# EAGLE design led_1_Arduino (EAGLE 8.7.1)
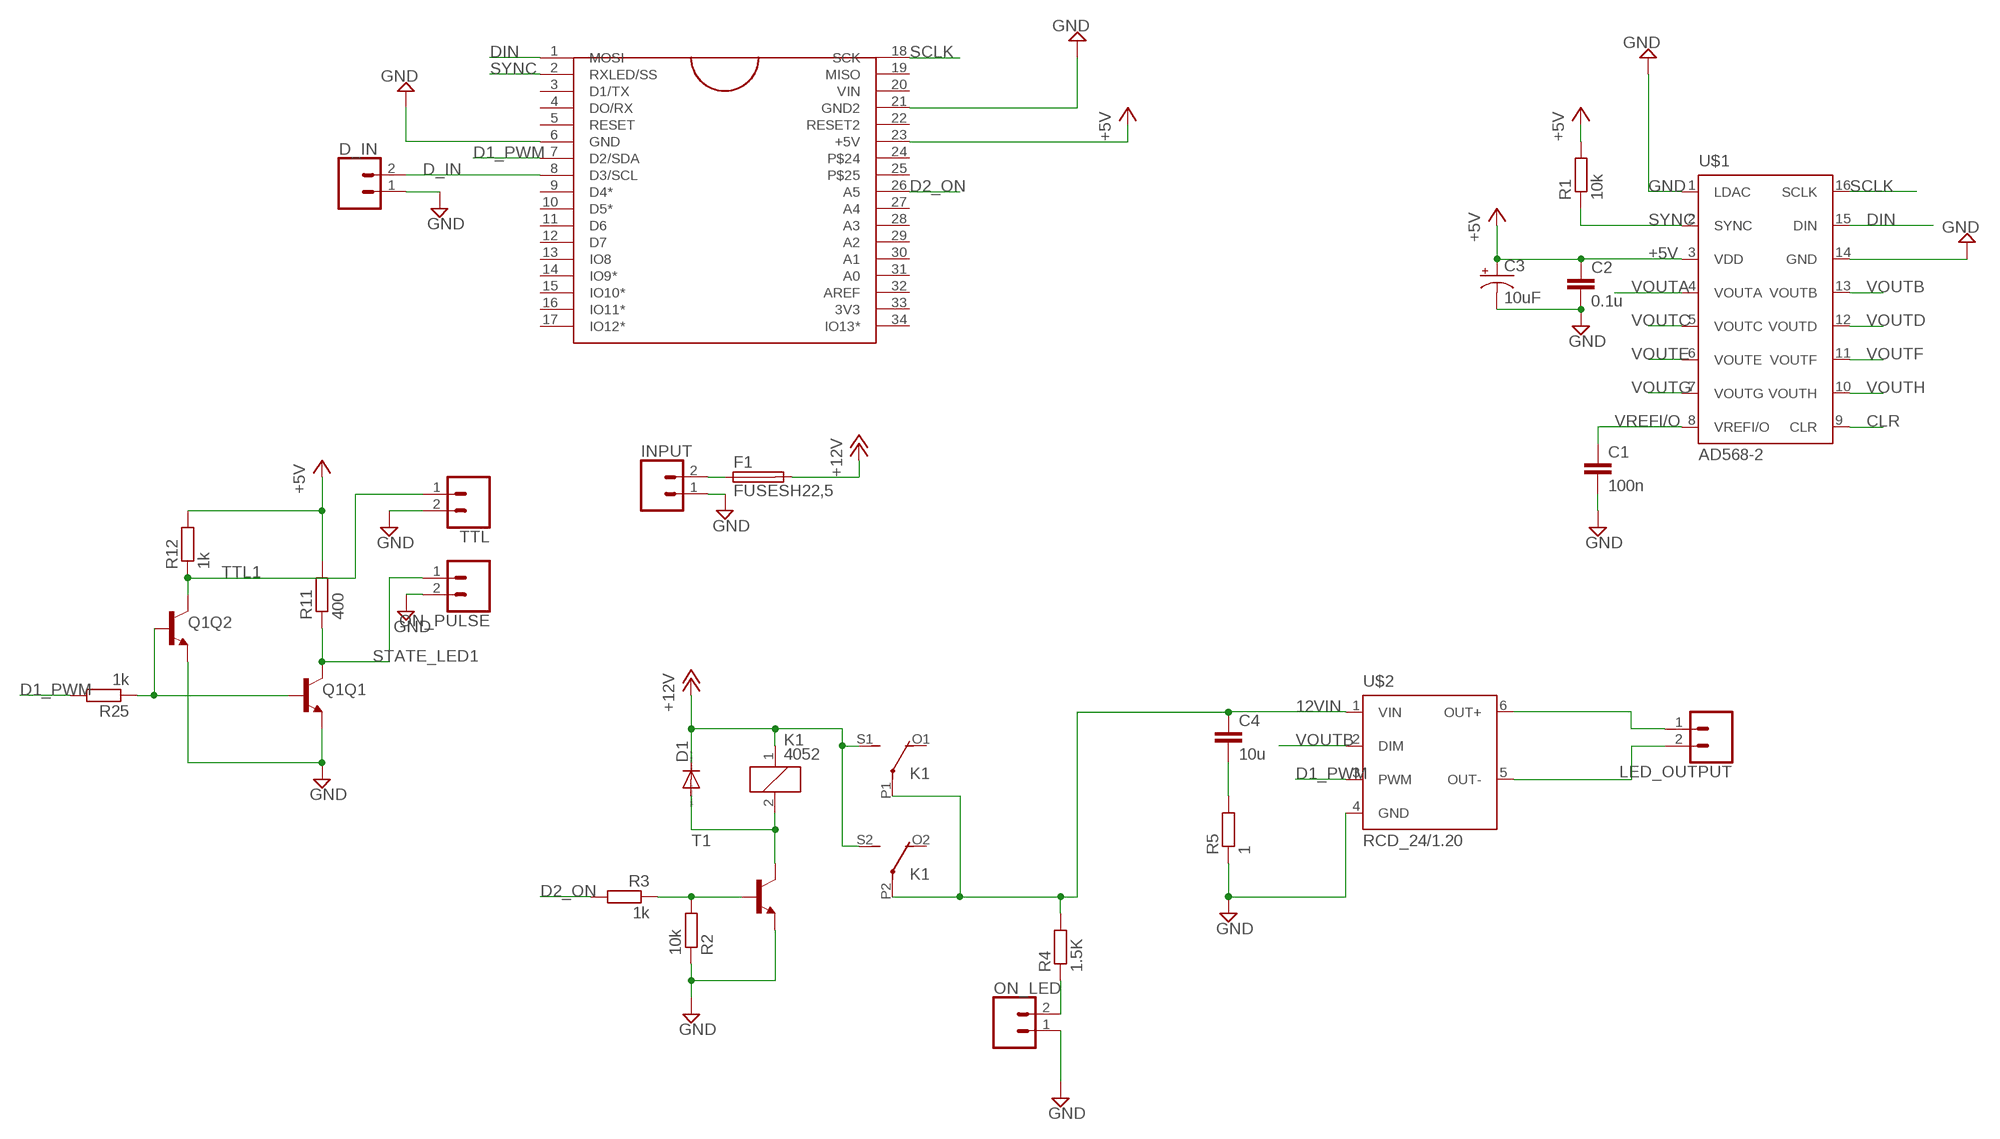
[diagram p0: schematic, sheet 1]

## Parts
C1  100n  C-EUC1206  [C1206]
C2  0.1u  C-EUC1206  [C1206]
C3  10uF  10UF-POLAR-EIA3528-20V-10%(TANT)  [EIA3528]
C4  10u  C-EUC1206  [C1206]
D1  DIODE-DO214AC  [DO214AC]
D_IN  CONN_02  [1X02]
F1  FUSESH22,5  [SH22,5]
INPUT  CONN_023.5MM  [SCREWTERMINAL-3.5MM-2]
K1  4052  [F4052]
LED_OUTPUT  CONN_023.5MM  [SCREWTERMINAL-3.5MM-2]
ON_LED  CONN_02  [1X02]
ON_PULSE  CONN_02  [1X02]
Q1  TRANS_NPN_DUAL_NSM4002-MBT3904DW1T1  [SC70-6]
R1  10k  R-EU_R1206  [R1206]
R2  10k  R-EU_R1206  [R1206]
R3  1k  R-EU_R0805  [R0805]
R4  1.5K  R-EU_R0805  [R0805]
R5  1  R-EU_R1206  [R1206]
R11  400  R-EU_R0805  [R0805]
R12  1k  R-EU_R0805  [R0805]
R25  1k  R-EU_R0805  [R0805]
T1  -NPN-SOT223  [SOT223]
TTL  CONN_02  [1X02]
U$1  AD568-2  [TSSOP-16]
U$2  RCD_24/1.20  [RCD-24/W/X3]
U$3  ARDUINO_MICRO  [ARDUINO_MICRO_PADS]

## Nets
12VIN: C4.1 K1.P1(2:P) K1.P2(3:P) R4.2 U$2.1(VIN)
+5V: C2.1 C3.A(+) R1.2 R11.2 R12.2 U$1.3(VDD) U$3.23(+5V)
+12V: D1.C F1.2 K1.1 K1.S1(2:S) K1.S2(3:S)
CLR: U$1.9(CLR)
D1_PWM: R25.2 U$2.3(PWM) U$3.7(D2/SDA)
D2_ON: R3.2 U$3.26(A5)
D_IN: D_IN.2 U$3.8(D3/SCL)
DIN: U$1.15(DIN) U$3.1(MOSI)
GND: C1.2 C2.2 C3.C(-) D_IN.1 INPUT.1 ON_LED.1 ON_PULSE.2 Q1.1(Q2:E) Q1.4(Q1:E) R2.1 R5.1 T1.3(E) TTL.2 U$1.1(LDAC) U$1.14(GND) U$2.4(GND) U$3.6(GND) U$3.21(GND2)
N$1: C4.2 R5.2
N$2: D1.A K1.2 T1.4(C)
N$3: F1.1 INPUT.2
N$4: ON_LED.2 R4.1
N$5: R2.2 R3.1 T1.1(B)
N$6: LED_OUTPUT.2 U$2.5(OUT-)
N$7: LED_OUTPUT.1 U$2.6(OUT+)
N$10: Q1.2(Q2:B) Q1.5(Q1:B) R25.1
SCLK: U$1.16(SCLK) U$3.18(SCK)
STATE_LED1: ON_PULSE.1 Q1.3(Q1:C) R11.1
SYNC: R1.1 U$1.2(SYNC) U$3.2(RXLED/SS)
TTL1: Q1.6(Q2:C) R12.1 TTL.1
VOUTA: U$1.4(VOUTA)
VOUTB: U$1.13(VOUTB) U$2.2(DIM)
VOUTC: U$1.5(VOUTC)
VOUTD: U$1.12(VOUTD)
VOUTE: U$1.6(VOUTE)
VOUTF: U$1.11(VOUTF)
VOUTG: U$1.7(VOUTG)
VOUTH: U$1.10(VOUTH)
VREFI/O: C1.1 U$1.8(VREFI/O)
Unconnected: K1.O1(2:O) K1.O2(3:O) U$3.3(D1/TX) U$3.4(DO/RX) U$3.5(RESET) U$3.9(D4*) U$3.10(D5*) U$3.11(D6) U$3.12(D7) U$3.13(IO8) U$3.14(IO9*) U$3.15(IO10*) U$3.16(IO11*) U$3.17(IO12*) U$3.19(MISO) U$3.20(VIN) U$3.22(RESET2) U$3.24 U$3.25 U$3.27(A4) U$3.28(A3) U$3.29(A2) U$3.30(A1) U$3.31(A0) U$3.32(AREF) U$3.33(3V3) U$3.34(IO13*)

## Library data of the parts
C1 C2 C4 = rcl:C-EU: CAPACITOR, European symbol; SPICEPREFIX: C
C3 = SparkFun-Capacitors:10UF-POLAR: 10.0µF polarized capacitors A capacitor is a passive two-terminal electrical component used to store electrical energy temporarily in an electric field.; PROD_ID: CAP-08063
D1 = diode:DIODE-: DIODE
D_IN ON_LED ON_PULSE TTL = SparkFun-Connectors:CONN_02: Multi connection point. Often used as Generic Header-pin footprint for 0.1 inch spaced/style header connections On any of the 0.1 inch spaced packages, you can populate with these: Break Away Headers - Straight <https://www.sparkfun.com/products/116> (PRT-00116) Break Away Male Headers - Right Angle <https://www.sparkfun.com/products/553> (PRT-00553) Female Headers <https://www.sparkfun.com/products/115> (PRT-00115) Break Away Headers - Machine Pin <https://www.sparkfun.com/products/117> (PRT-00117) Break Away Female Headers - Swiss Machine Pin <https://www.sparkfun.com/products/743> (PRT-00743) For SCREWTERMINALS and SPRING TERMINALS visit here: Screw Terimnals on SparkFun.com <https://www.sparkfun.com/search/results?term=Screw+Terminals> (5mm/3.5mm/2.54mm spacing) This device is also useful as a general connection point to wire up your design to another part of your project. Our various solder wires solder well into these plated through hole pads. Hook-Up Wire - Assortment (Stranded, 22 AWG) <https://www.sparkfun.com/products/11375> (PRT-11375) Hook-Up Wire - Assortment (Solid Core, 22 AWG) <https://www.sparkfun.com/products/11367> (PRT-11367) View the entire wire category on our website here <https://www.sparkfun.com/categories/141> Special notes: Molex polarized connector foot print use with: PRT-08233 with associated crimp pins and housings. 2.54_SCREWTERM for use with PRT-10571. 3.5mm Screw Terminal footprints for PRT-08084 5mm Screw Terminal footprints for use with PRT-08432
F1 = fuse:FUSE: Fuse; OC_FARNELL: unknown; OC_NEWARK: unknown
INPUT LED_OUTPUT = SparkFun-Connectors:CONN_02: Multi connection point. Often used as Generic Header-pin footprint for 0.1 inch spaced/style header connections On any of the 0.1 inch spaced packages, you can populate with these: Break Away Headers - Straight <https://www.sparkfun.com/products/116> (PRT-00116) Break Away Male Headers - Right Angle <https://www.sparkfun.com/products/553> (PRT-00553) Female Headers <https://www.sparkfun.com/products/115> (PRT-00115) Break Away Headers - Machine Pin <https://www.sparkfun.com/products/117> (PRT-00117) Break Away Female Headers - Swiss Machine Pin <https://www.sparkfun.com/products/743> (PRT-00743) For SCREWTERMINALS and SPRING TERMINALS visit here: Screw Terimnals on SparkFun.com <https://www.sparkfun.com/search/results?term=Screw+Terminals> (5mm/3.5mm/2.54mm spacing) This device is also useful as a general connection point to wire up your design to another part of your project. Our various solder wires solder well into these plated through hole pads. Hook-Up Wire - Assortment (Stranded, 22 AWG) <https://www.sparkfun.com/products/11375> (PRT-11375) Hook-Up Wire - Assortment (Solid Core, 22 AWG) <https://www.sparkfun.com/products/11367> (PRT-11367) View the entire wire category on our website here <https://www.sparkfun.com/categories/141> Special notes: Molex polarized connector foot print use with: PRT-08233 with associated crimp pins and housings. 2.54_SCREWTERM for use with PRT-10571. 3.5mm Screw Terminal footprints for PRT-08084 5mm Screw Terminal footprints for use with PRT-08432; PROD_ID: CONN-08399
K1 = relay:4052: RELAY 2 x switch, Finder; OC_FARNELL: unknown; OC_NEWARK: unknown
Q1 = SparkFun-DiscreteSemi:TRANS_NPN_DUAL_NSM4002: Dual NPN Transistors in Single Package The MBT3904W1 puts two general purpose 3904 NPN transistors in a single package. Datasheet <http://www.onsemi.com/pub_link/Collateral/MBT3904DW1T1-D.PDF> SparkFun Products: SparkFun ESP32 Thing <https://www.sparkfun.com/products/13907>; PROD_ID: TRANS-13337
R1-R5 R11 R12 R25 = rcl:R-EU_: RESISTOR, European symbol; SPICEPREFIX: R
T1 = transistor-neu-to92:*-NPN-: NPN Transistror
U$1 = opto_stimulation:AD568-2
U$2 = opto_stimulation:RCD_24/1.20
U$3 = opto_stimulation:ARDUINO_MICRO; SPICEPREFIX: X

## Board
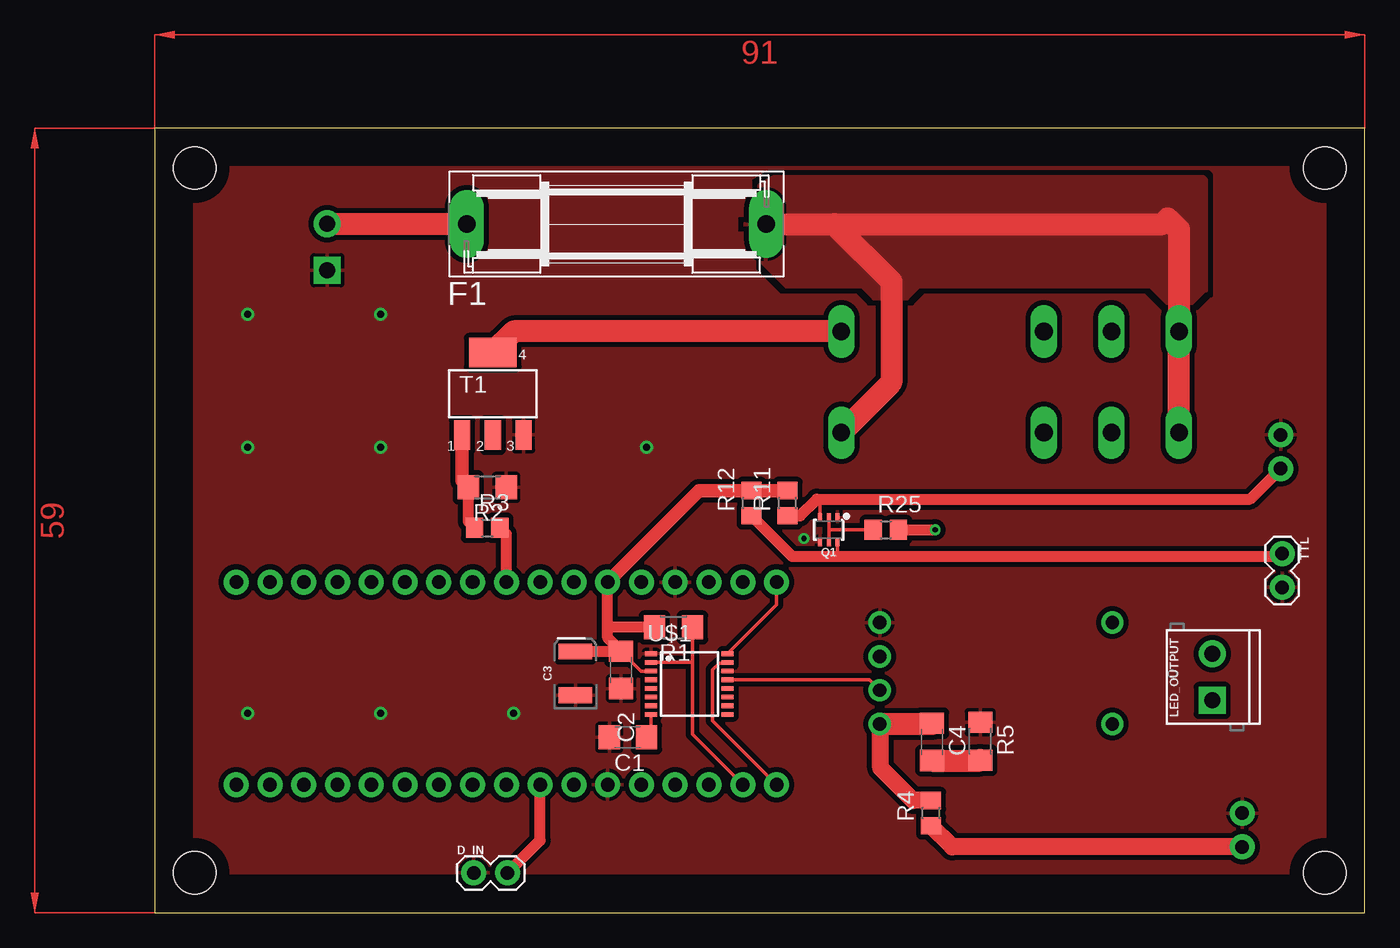
[diagram p1: board, top side]
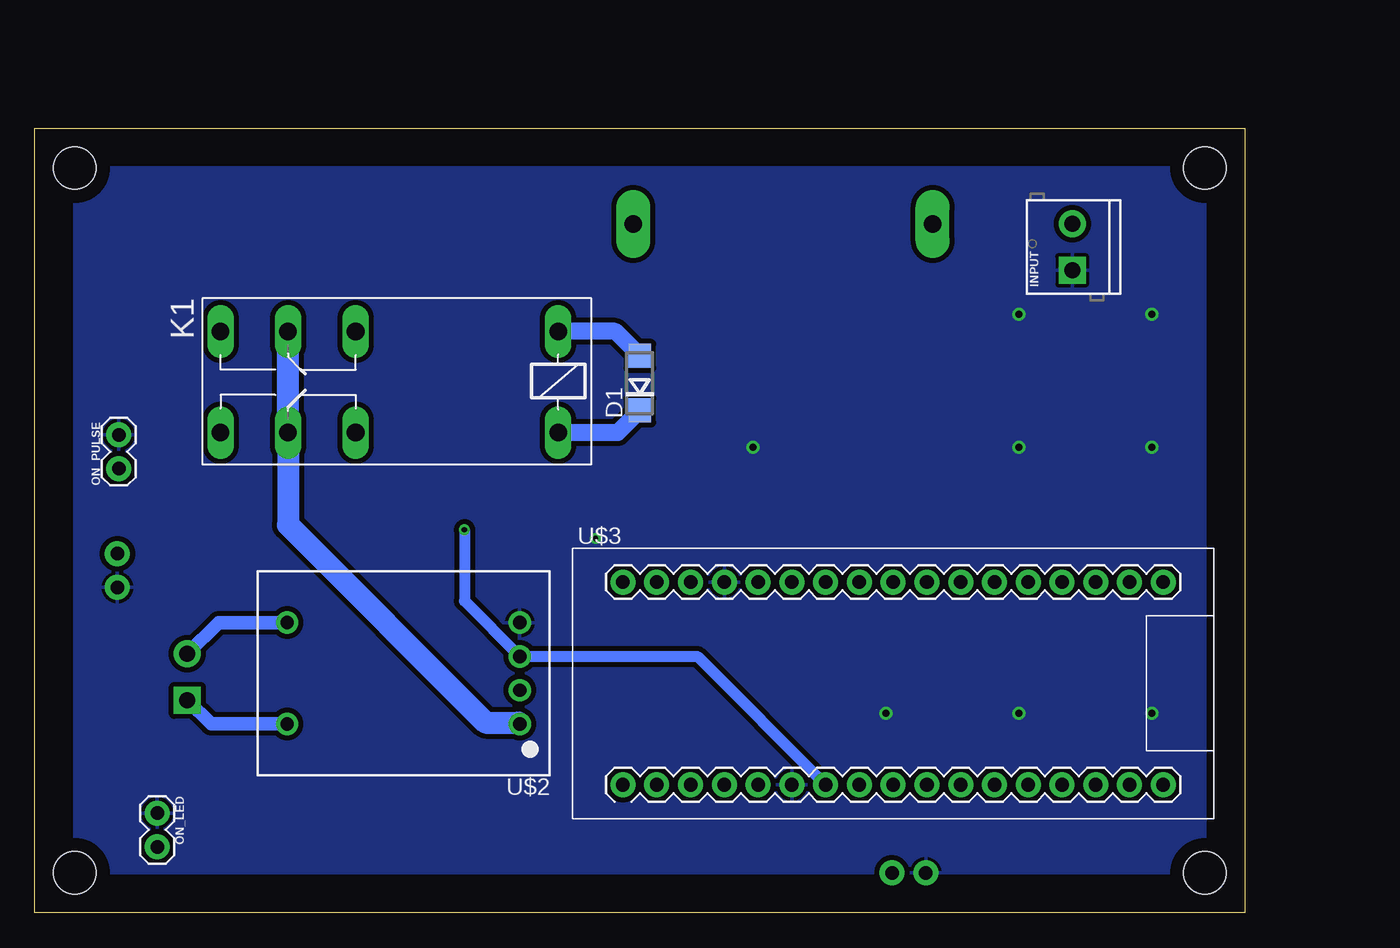
[diagram p2: board, bottom side, seen from below]

Size 91 x 59 mm. Coordinates in mm from the lower left corner, seen from the top.
Outline: 0,0 91,0 91,59 0,59 0,0
Copper layers (1*16): Top 0.035mm / dielectric 1.5mm / Bottom 0.035mm
Design rules "default *": minimum track width 6mil, minimum drill 0.35mm, track to track 15mil, track to pad 12mil, pad to pad 10mil, via to via 15mil, smd to smd 6mil, copper to edge 40mil, drill to drill 6mil, minimum pad ring 10mil, minimum via ring 8mil, stop-mask expansion 4mil, vias tented up to drill 0mil, thermal gap 10mil
Holes 3.2 mm at 3,3 88,3 88,56 3,56

### Footprints (pad centres in the part's own frame; a part is rotated, then mirrored left to right if it is on the bottom)
C1206 = smd 1.6 x 1.8: 1 -1.4,0; 2 1.4,0
EIA3528 = smd 1.2 x 2.5: A 1.65,0; C -1.65,0
DO214AC = smd 1.8 x 1.7: A 2.05,0; C -2.05,0
1X02 = drill 1.016 pad 1.88: 1 0,0; 2 2.54,0
SH22,5 = drill 1.321 pad 2.54 long: 1 -11.252,0; 2 11.252,0
SCREWTERMINAL-3.5MM-2 = drill 1.2 pad 2.032 square: 1 0,0 | drill 1.2 pad 2.032: 2 3.5,0
F4052 = drill 1.321 long: 1 -3.81,3.81; 2 -3.81,-3.81; O1 11.43,-3.81; O2 11.43,3.81; P1 16.51,-3.81; P2 16.51,3.81; S1 21.59,-3.81; S2 21.59,3.81
SC70-6 = smd 0.3 x 0.66: 1 -0.65,-0.92; 2 0,-0.92; 3 0.65,-0.92; 4 0.65,0.92; 5 0,0.92; 6 -0.65,0.92
R1206 = smd 1.6 x 1.803: 1 -1.422,0; 2 1.422,0
R0805 = smd 1.3 x 1.5: 1 -0.95,0; 2 0.95,0
SOT223 = smd 1.219 x 2.235: 1 -2.311,-3.099; 2 0,-3.099; 3 2.311,-3.099 | smd 3.6 x 2.2: 4 0,3.099
TSSOP-16 = smd 0.9 x 0.35: 1 -2.875,2.275; 2 -2.875,1.625; 3 -2.875,0.975; 4 -2.875,0.325; 5 -2.875,-0.325; 6 -2.875,-0.975; 7 -2.875,-1.625; 8 -2.875,-2.275; 9 2.875,-2.275; 10 2.875,-1.625; 11 2.875,-0.975; 12 2.875,-0.325; 13 2.875,0.325; 14 2.875,0.975; 15 2.875,1.625; 16 2.875,2.275
RCD-24/W/X3 = drill 1 pad 1.676: 1 -8.75,3.81; 2 -8.75,1.27; 3 -8.75,-1.27; 4 -8.75,-3.81; 5 8.75,-3.81; 6 8.75,3.81
ARDUINO_MICRO_PADS = drill 1.016 pad 1.88: 1 0,0; 2 2.54,0; 3 5.08,0; 4 7.62,0; 5 10.16,0; 6 12.7,0; 7 15.24,0; 8 17.78,0; 9 20.32,0; 10 22.86,0; 11 25.4,0; 12 27.94,0; 13 30.48,0; 14 33.02,0; 15 35.56,0; 16 38.1,0; 17 40.64,0; 18 0,15.24; 19 2.54,15.24; 20 5.08,15.24; 21 7.62,15.24; 22 10.16,15.24; 23 12.7,15.24; 24 15.24,15.24; 25 17.78,15.24; 26 20.32,15.24; 27 22.86,15.24; 28 25.4,15.24; 29 27.94,15.24; 30 30.48,15.24; 31 33.02,15.24; 32 35.56,15.24; 33 38.1,15.24; 34 40.64,15.24

### Placement (x,y rotation side)
C1  35.6,13.18 180 top
C2  35.09,18.26 270 top
C3  31.64,18 90 top
C4  58.48,12.85 270 top
D1  45.51,39.82 90 bottom
D_IN  24,3 0 top
F1  34.74,51.79 0 top
INPUT  12.98,48.31 90 bottom
K1  55.45,39.91 180 bottom
LED_OUTPUT  79.54,15.98 90 top
ON_LED  81.8,7.5 270 bottom
ON_PULSE  84.7,33.4 90 bottom
Q1  50.7,28.8 180 top
R1  39.03,21.46 180 top
R2  25.02,31.99 180 top
R3  25.02,28.94 0 top
R4  58.4,7.5 90 top
R5  62.1,12.9 270 top
R11  47.6,30.8 90 top
R12  44.9,30.8 90 top
R25  55,28.8 0 top
T1  25.43,39.03 0 top
TTL  84.8,27 270 top
U$1  40.22,17.2 0 top
U$2  63.28,18.01 180 bottom
U$3  46.77,9.63 0 bottom

### Tracks (layer width: path | path; a pad name or v marks a point on that pad's centre or on a via)
12VIN
  Top 1.27: R4.2 57.05,8.45 54.6,10.9 54.6,14.13 U$2.1
  Top 1.651: U$2.1 58.43,14.2 C4.1
  Bottom 1.651: U$2.1 54.63,14.3 57.1,14.3 71.96,29.16 K1.P2 K1.P1
+5V
  Top 0.254: U$1.3 36.58,18.17 C2.1
  Top 0.813: 34.07,21.57 34.07,20.68 C2.1 34.71,19.66 34.69,19.65 C3.A | 34.07,21.57 U$3.23 | R1.2 34.18,21.46 34.07,21.57
  Top 1.016: R11.2 R12.2 40.96,31.75 U$3.23
+12V
  Top 1.651: K1.S2 K1.S1 77.04,51.36 76.2,52.2 75.79,51.79 51.11,51.79 | K1.1 55.4,39.85 55.4,47.5 51.11,51.79 | F1.2 51.11,51.79
  Bottom 1.27: D1.C 47.18,36.1 K1.1
  pour Top: 44.4,54 44.4,50.2 47.5,47.1 53.2,47.1 54.1,46.2 56.6,46.2 57.5,47.1 74.9,47.1 76.2,45.8 77.6,45.8 77.8,45.6 79,46.8 79.1,46.8 79.1,55.1 78.9,55.3 46.5,55.3
D1_PWM  (via drill 0.4)
  Top 0.813: R25.2 v58.7,28.8
  Bottom 0.813: U$3.7 41.19,19.28 U$2.3 58.7,23.45 v58.7,28.8
D2_ON
  Top 0.813: R3.2 26.44,28.46 U$3.26
  Top 1.016: U$3.26
D_IN
  Top 0.813: D_IN.2 28.99,5.45 U$3.8
DIN
  Top 0.254: U$1.15 43.05,18.78 42.47,18.78 41.95,18.26 41.95,14.45 U$3.1
GND  (via drill 0.4, 0.55)
  other vias: 7,15 17,15 27,15 7,35 17,35 17,45 7,45 37,35 48.84,28.14
  pour Top (isolate 0.254, rank 2): 3,56 3,3 88,3 88,56
  pour Bottom (isolate 0.254, rank 2): 3,56 3,3 88,3 88,56
N$1
  Top 1.651: C4.2 62.07,11.45 R5.2
N$2
  Top 1.651: K1.2 27.02,43.72 T1.4
  Bottom 1.27: D1.A 47.35,43.72 K1.2
N$3
  Top 1.651: F1.1 13.01,51.79 INPUT.2
N$4
  Top 1.27: ON_LED.2 59.99,4.96 R4.1
N$5
  Top 0.813: R3.1 23.6,29.41 R2.2
  Top 1.016: T1.1 23.12,32.47 R2.2
N$6
  Bottom 1.016: U$2.5 77.2,21.82 LED_OUTPUT.2
N$7
  Bottom 1.016: U$2.6 77.76,14.2 LED_OUTPUT.1
N$10
  Top 0.254: Q1.5 50.7,28.8 | 50.7,28.8 Q1.2 | 50.7,28.8 R25.1
SCLK
  Top 0.254: U$1.16 46.77,23.15 U$3.18
STATE_LED1
  Top 0.254: Q1.3 50.05,30.85 49.8,31.1
  Top 0.813: R11.1 48.55,29.85 49.8,31.1 82.4,31.1 ON_PULSE.1
SYNC
  Top 0.254: U$3.2 40.45,13.41 40.45,18.77 | 40.45,18.77 R1.1 | U$1.2 40.4,18.82 40.45,18.77
TTL1
  Top 0.254: Q1.6 51.35,26.85 51.4,26.8
  Top 0.813: R12.1 47.95,26.8 51.4,26.8 84.6,26.8 TTL.1
VOUTB
  Top 0.254: U$1.13 53.75,17.52 U$2.2
VREFI/O
  Top 0.254: C1.1 37.35,13.53 U$1.8
(copper drawn outside any net)
  shapes: Top area x2